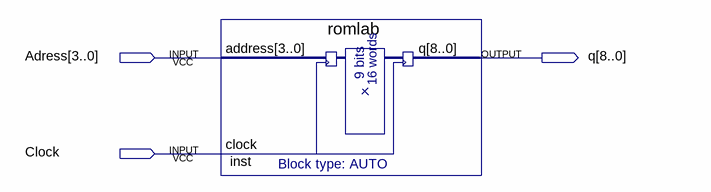
[diagram p0: schematic sheet]
// Quartus schematic 2500510027.bdf as structural Verilog: 1 symbols, 3 pins
module \2500510027  (
  input  [3:0] Adress,
  input  Clock,
  output [8:0] q
);

  romlab inst (.address(Adress), .clock(Clock), .q(q));
endmodule
